# Altium schematic sheet FPGA_Power.SchDoc: FPGA POWER
size A4; DocumentNumber: 10; SheetNumber: 10; SheetTotal: 18
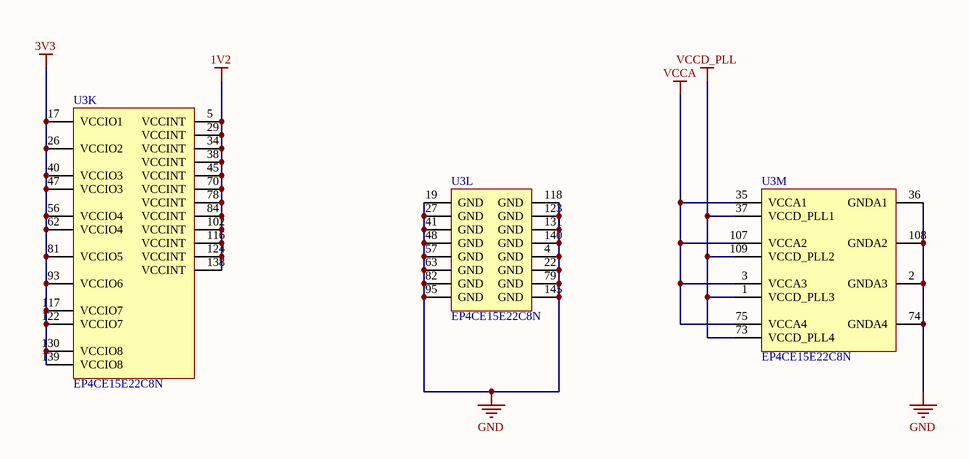
[diagram p0: FPGA_Power.SchDoc]

## Parts
U3  EP4CE15E22C8N  [EQFP144_A-165_D2-67_N]  (parts K,L,M of 13)

## Nets
1V2: U3.5(VCCINT) U3.29(VCCINT) U3.34(VCCINT) U3.38(VCCINT) U3.45(VCCINT) U3.70(VCCINT) U3.78(VCCINT) U3.84(VCCINT) U3.102(VCCINT) U3.116(VCCINT) U3.124(VCCINT) U3.138(VCCINT)
3V3: U3.17(VCCIO1) U3.26(VCCIO2) U3.40(VCCIO3) U3.47(VCCIO3) U3.56(VCCIO4) U3.62(VCCIO4) U3.81(VCCIO5) U3.93(VCCIO6) U3.117(VCCIO7) U3.122(VCCIO7) U3.130(VCCIO8) U3.139(VCCIO8)
GND: U3.2(GNDA3) U3.4(GND) U3.19(GND) U3.22(GND) U3.27(GND) U3.36(GNDA1) U3.41(GND) U3.48(GND) U3.57(GND) U3.63(GND) U3.74(GNDA4) U3.79(GND) U3.82(GND) U3.95(GND) U3.108(GNDA2) U3.118(GND) U3.123(GND) U3.131(GND) U3.140(GND) U3.145(GND)
VCCA: U3.3(VCCA3) U3.35(VCCA1) U3.75(VCCA4) U3.107(VCCA2)
VCCD_PLL: U3.1(VCCD_PLL3) U3.37(VCCD_PLL1) U3.73(VCCD_PLL4) U3.109(VCCD_PLL2)

## Notes on the sheet
- Title
- Size:
- Date:
- A4
- Number:
- Time:
- Revision:
- Sheet
- of
- File:

## Library data of the parts
U3 = EP4CE15E22C8N: Cyclone IV Family FPGA, 1.2V Core, 81 I/O Pins, 4 PLLs, 144-Pin QFP, Speed Grade 8, Commercial Grade, Pb-Free; Manufacturer: Altera; DatasheetVersion: ver1.6, Nov-2011; PackageVersion: ver1.0, Jun-2011; PackageReference: EQFP144_A-165_D2-67; PackageDescription: 144-Pin Plastic Enhanced Quad Flat Pack (EQFP) - Wire Bond - A:1.65 - D2:6.7; Code_JEDEC: MS-026-BFB-HD; ComponentLink1Description: Manufacturer URL; ComponentLink1URL: http://www.altera.com/; ComponentLink2Description: Handbook; ComponentLink2URL: http://www.altera.com/literature/hb/cyclone-iv/cyclone4-handbook.pdf; ComponentLink3Description: Pinout; ComponentLink3URL: http://www.altera.com/literature/lit-dp.jsp?category=cyc%204&showspreadsheet=y; ComponentLink4Description: Package Specification; ComponentLink4URL: http://www.altera.com/devicepackaging/04R00221-02.pdf